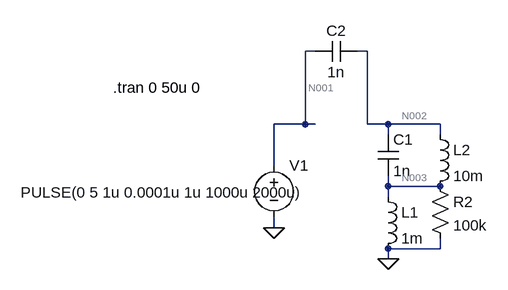
[diagram p0: schematic Draft1.asc]
Draft1.asc, the LTspice schematic file:
Version 4.1
SHEET 1 880 680
WIRE -16 -96 -32 -96
WIRE 64 -96 48 -96
WIRE -32 16 -32 -96
WIRE -32 16 -80 16
WIRE -16 16 -32 16
WIRE 64 16 64 -96
WIRE 96 16 64 16
WIRE 176 16 96 16
WIRE 96 32 96 16
WIRE 176 32 176 16
WIRE -80 80 -80 16
WIRE 96 112 96 96
WIRE 176 112 96 112
WIRE 96 128 96 112
WIRE -80 176 -80 160
WIRE 176 208 176 192
WIRE 176 208 96 208
WIRE 96 224 96 208
FLAG 96 224 0
FLAG -80 176 0
SYMBOL voltage -80 64 R0
WINDOW 3 -390 57 Left 2
WINDOW 123 0 0 Left 0
WINDOW 39 0 0 Left 0
SYMATTR InstName V1
SYMATTR Value PULSE(0 5 1u 0.0001u 1u 1000u 2000u)
SYMBOL ind 80 112 R0
SYMATTR InstName L1
SYMATTR Value 1m
SYMATTR SpiceLine Rser=0
SYMBOL cap 80 32 R0
SYMATTR InstName C1
SYMATTR Value 1n
SYMBOL ind 160 16 R0
SYMATTR InstName L2
SYMATTR Value 10m
SYMATTR SpiceLine Rser=1m
SYMBOL res 160 96 R0
SYMATTR InstName R2
SYMATTR Value 100k
SYMBOL cap 48 -112 R90
WINDOW 0 0 32 VBottom 2
WINDOW 3 32 32 VTop 2
SYMATTR InstName C2
SYMATTR Value 1n
TEXT -328 -40 Left 2 !.tran 0 50u 0

The netlist it stands for:
* Draft1.asc
V1 N001 0 PULSE(0 5 1u 0.0001u 1u 1000u 2000u)
L1 N003 0 1m Rser=0
C1 N002 N003 1n
L2 N002 N003 10m Rser=1m
R2 N003 0 100k
C2 N002 N001 1n
.tran 0 50u 0
.backanno
.end

* Results of the author's LTspice run, read from the files saved beside the schematic
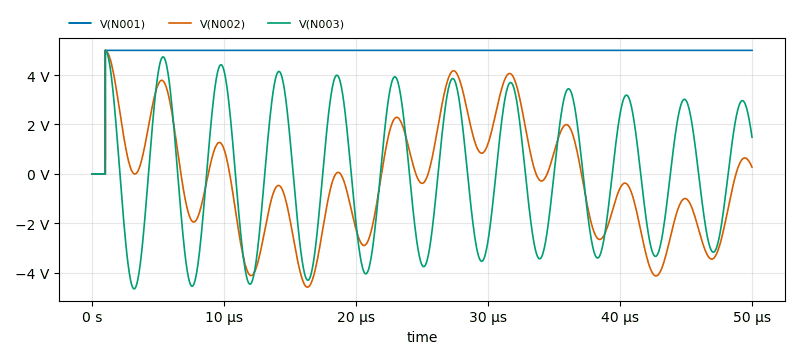
[diagram p1: Transient Analysis of Draft1.asc, plotted from the saved traces]
* Transient Analysis, 1 run:
*   V(N001): min 0 V, max 5 V, average 4.9 V, rms 4.95 V, last 5 V
*   V(N002): min -4.584 V, max 5 V, average -216.5 mV, rms 2.278 V, last 274.4 mV
*   V(N003): min -4.651 V, max 5 V, average 24.44 mV, rms 2.73 V, last 1.488 V